# EAGLE design USBOptoIso (EAGLE 6.5.0)
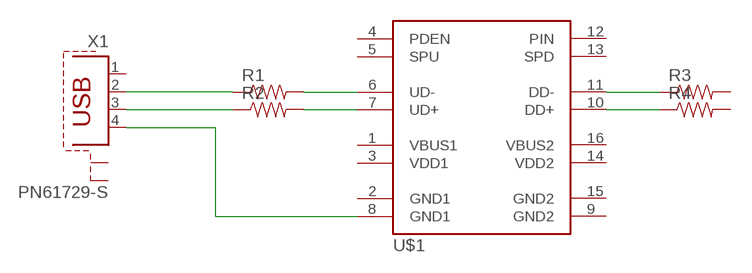
[diagram p0: schematic, sheet 1]

## Parts
R1  RESISTORKIT  [AXIAL-0.3-KIT]
R2  RESISTORKIT  [AXIAL-0.3-KIT]
R3  RESISTORKIT  [AXIAL-0.3-KIT]
R4  RESISTORKIT  [AXIAL-0.3-KIT]
U$1  ADUM4160  [SO16W]
X1  PN61729-S  [PN61729-S]

## Nets
N$1: R1.P$2 U$1.6(UD-)
N$2: R2.P$2 U$1.7(UD+)
N$3: R3.P$1 U$1.11(DD-)
N$4: R4.P$1 U$1.10(DD+)
N$5: R1.P$1 X1.2
N$6: R2.P$1 X1.3
N$7: U$1.8(GND1) X1.4
Unconnected: R3.P$2 R4.P$2 U$1.1(VBUS1) U$1.2(GND1) U$1.3(VDD1) U$1.4(PDEN) U$1.5(SPU) U$1.9(GND2) U$1.12(PIN) U$1.13(SPD) U$1.14(VDD2) U$1.15(GND2) U$1.16(VBUS2) X1.1 X1.S1 X1.S2

## Library data of the parts
R1-R4 = SparkFun-Resistors:RESISTOR: Resistor Basic schematic elements and footprints for 0603, 1206, and PTH resistors.
U$1 = adum4160:ADUM4160: Analog Devices ADuM4160 Low/Full Speed USB Isolator. Production-tested footprint. Created by Circuits At Home http://www.circuitsathome.com Free to use for non-commercial purposes
X1 = con-berg:PN61729-S: BERG USB connector; OC_FARNELL: unknown; OC_NEWARK: unknown

## Board
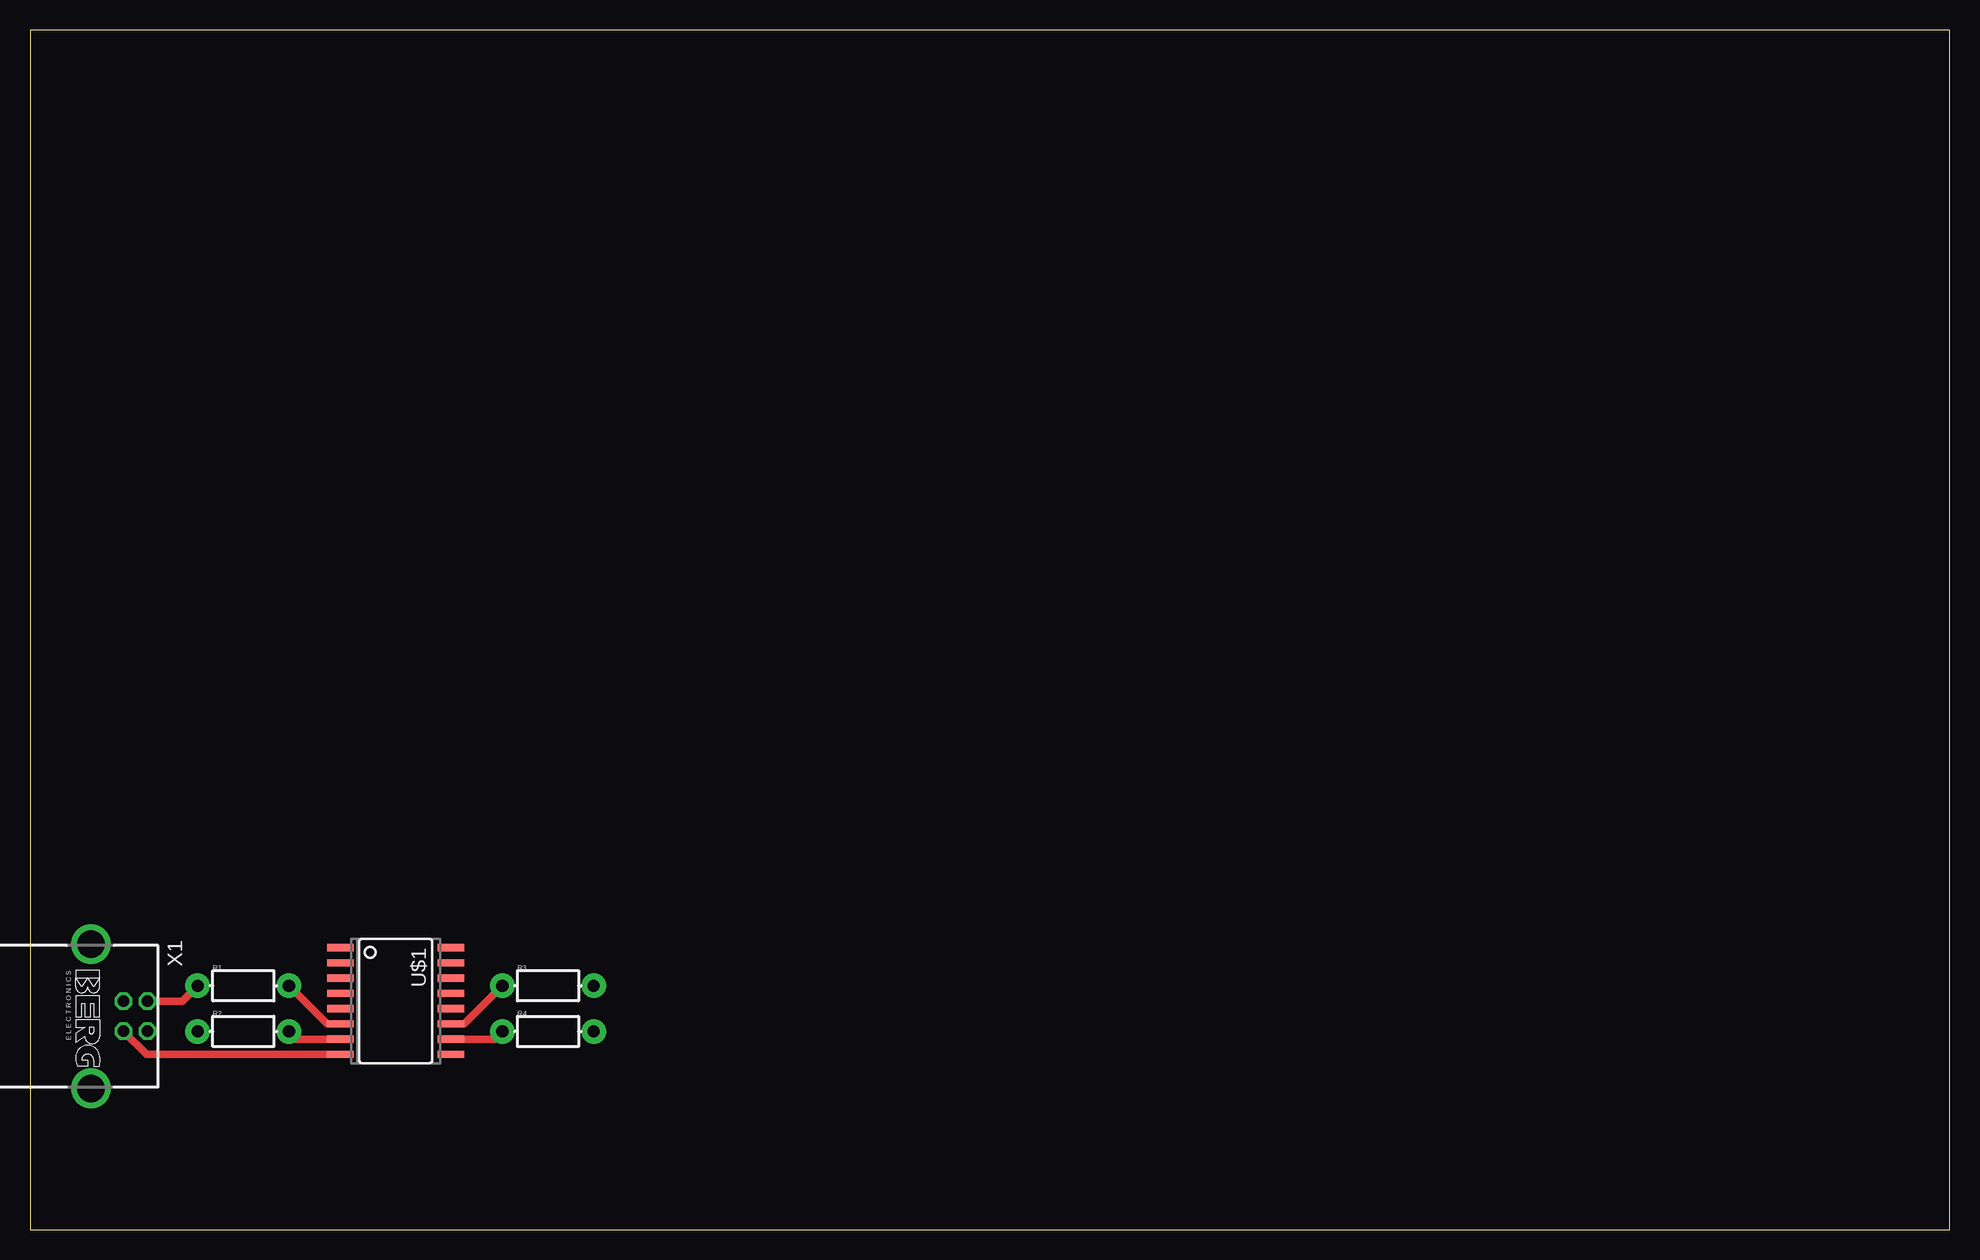
[diagram p1: board, top side]
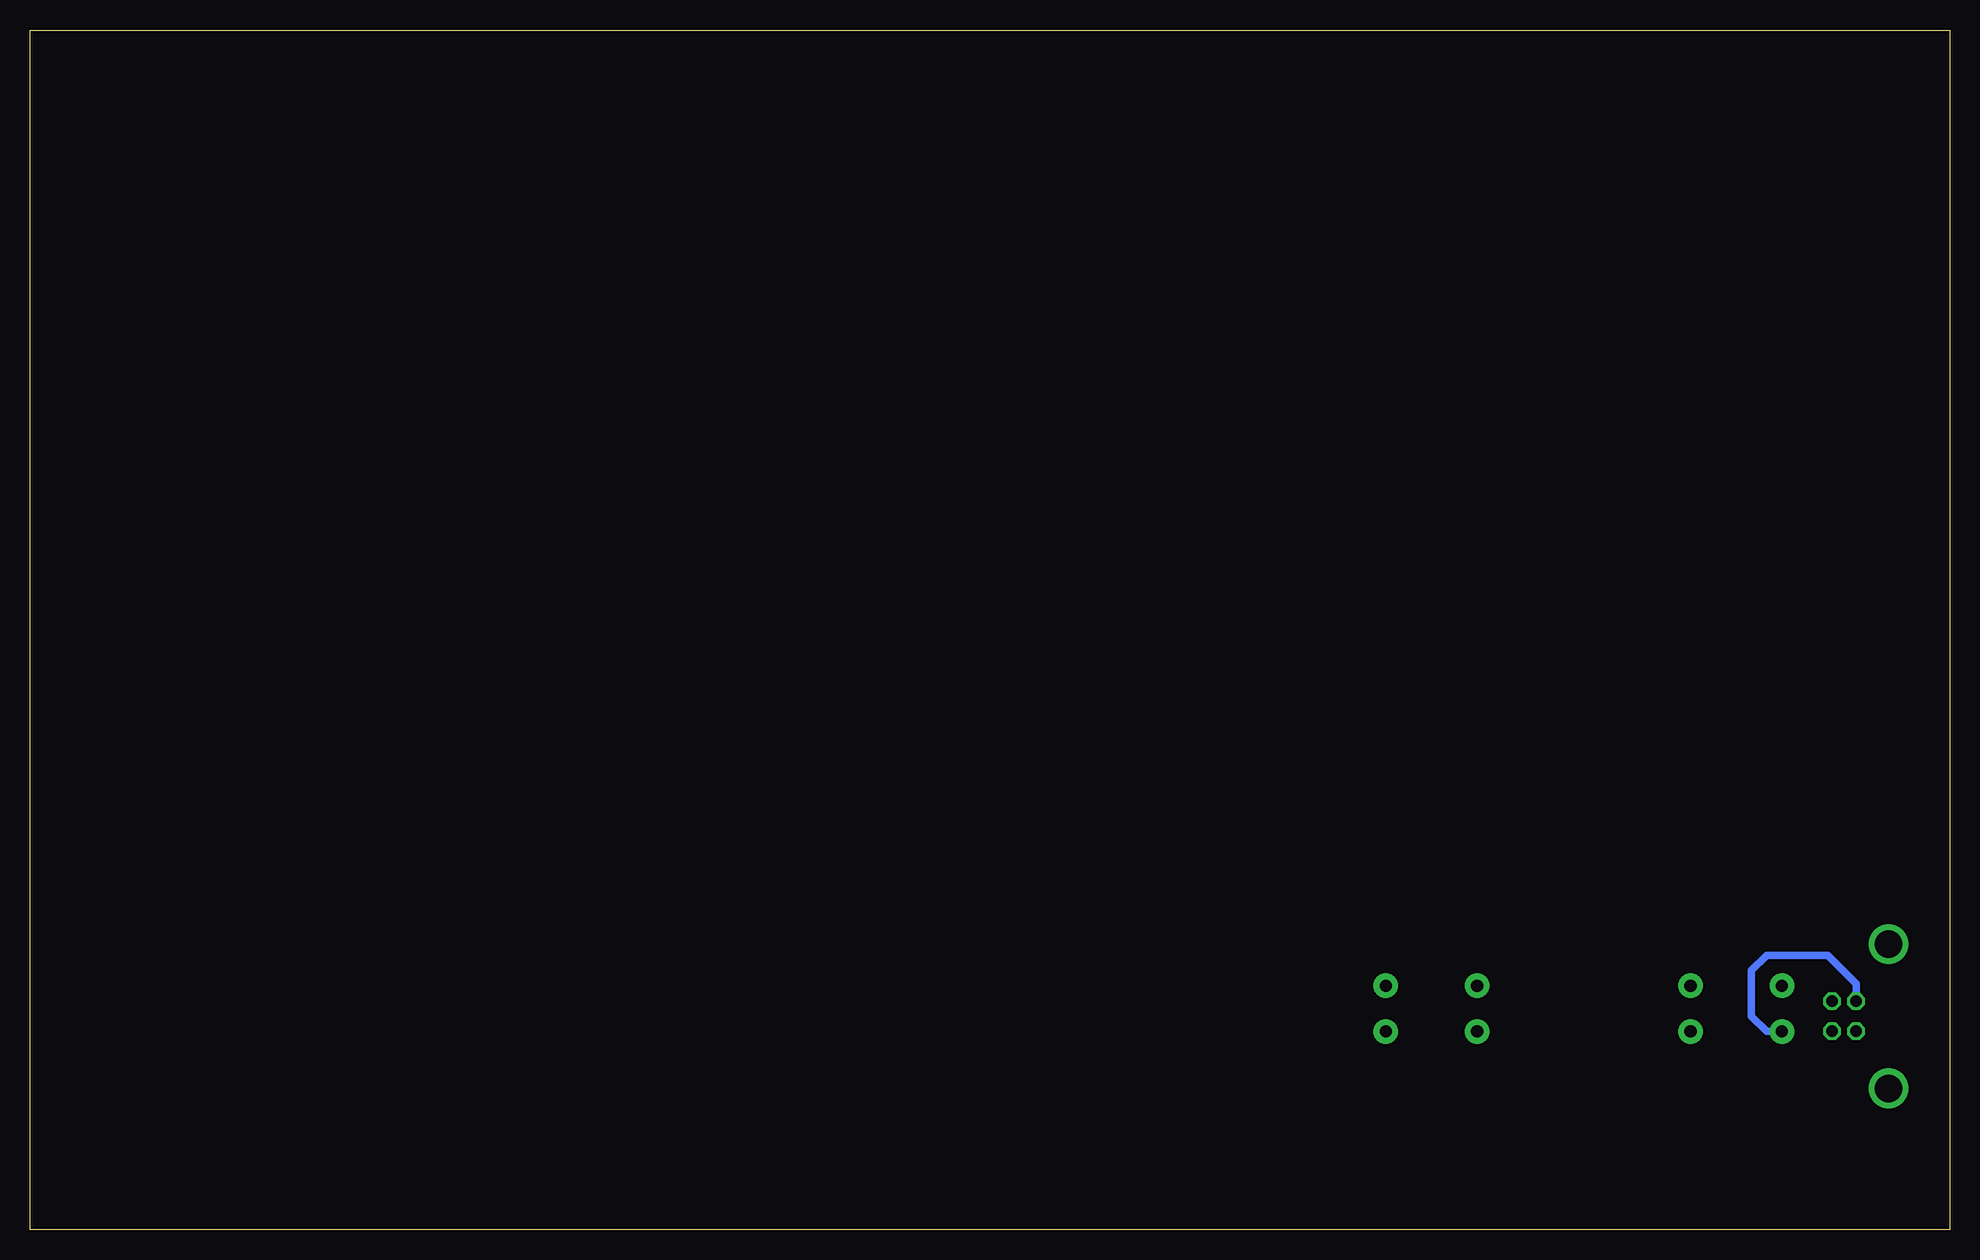
[diagram p2: board, bottom side, seen from below]

Size 160 x 100 mm. Coordinates in mm from the lower left corner, seen from the top.
Outline: 0,0 160,0 160,100 0,100 0,0
Copper layers (1*16): Top 0.035mm / dielectric 1.5mm / Bottom 0.035mm
Design rules "default": minimum track width 10mil, minimum drill 24mil, track to track 8mil, track to pad 8mil, pad to pad 8mil, via to via 8mil, smd to smd 8mil, copper to edge 40mil, drill to drill 8mil, minimum pad ring 10mil, minimum via ring 8mil, stop-mask expansion 4mil, vias tented up to drill 0mil, thermal gap 10mil

### Footprints (pad centres in the part's own frame; a part is rotated, then mirrored left to right if it is on the bottom)
AXIAL-0.3-KIT = drill 1.016 pad 2.032: P$1 -3.81,0; P$2 3.81,0
SO16W = smd 0.6 x 2.2: 1 -4.445,-4.6; 2 -3.175,-4.6; 3 -1.905,-4.6; 4 -0.635,-4.6; 5 0.635,-4.6; 6 1.905,-4.6; 7 3.175,-4.6; 8 4.445,-4.6; 9 4.445,4.6; 10 3.175,4.6; 11 1.905,4.6; 12 0.635,4.6; 13 -0.635,4.6; 14 -1.905,4.6; 15 -3.175,4.6; 16 -4.445,4.6
PN61729-S = drill 0.95 octagon: 1 1.25,4.71; 2 -1.25,4.71; 3 -1.25,2.71; 4 1.25,2.71 | drill 2.3 pad 2.9: S1 -6.02,0; S2 6.02,0

### Placement (x,y rotation side)
R1  17.78,20.32 0 top
R2  17.78,16.51 0 top
R3  43.18,20.32 0 top
R4  43.18,16.51 0 top
U$1  30.48,19.05 270 top
X1  5.08,17.78 270 top

### Tracks (layer width: path | path; a pad name or v marks a point on that pad's centre or on a via)
N$1
  Top 0.61: 24.13,17.78 R1.P$2 24.77,17.14 U$1.6
N$2
  Top 0.61: U$1.7 22.23,15.88 R2.P$2
N$3
  Top 0.61: U$1.11 36.2,17.14 R3.P$1
N$4
  Top 0.61: U$1.10 38.73,15.88 R4.P$1
N$5
  Top 0.61: X1.2 12.68,19.03 R1.P$1
N$6
  Bottom 0.61: X1.3 7.79,20.49 10.16,22.86 15.24,22.86 16.51,21.59 16.51,17.78 15.24,16.51 R2.P$1
N$7
  Top 0.61: U$1.8 9.71,14.61 X1.4